# Altium schematic sheet dcdc.SchDoc
size 420 x 297 mm; SheetNumber: 1; SheetTotal: 2
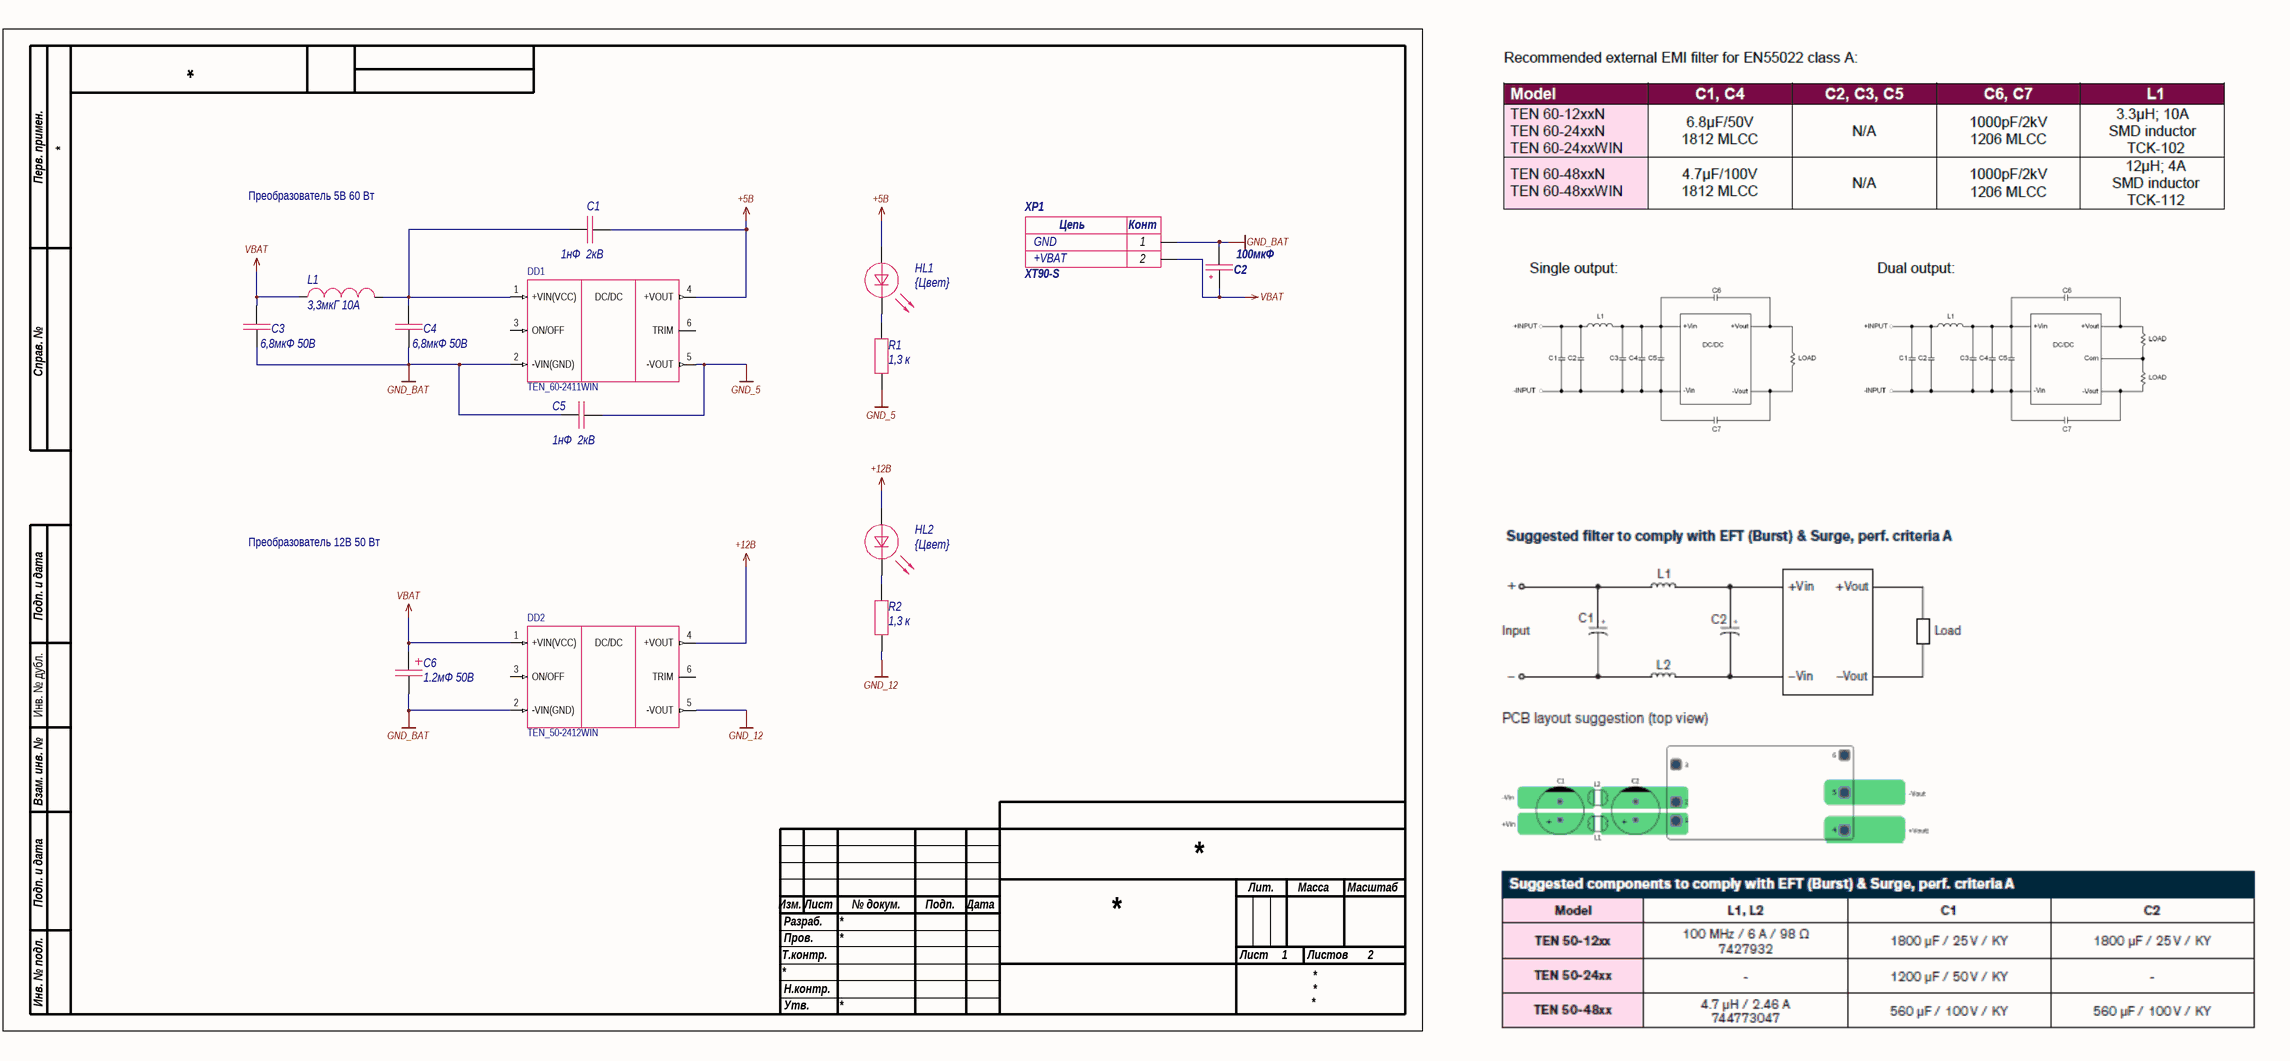
[diagram p0: dcdc.SchDoc]

## Parts
C1  value 1нФ  2кВ  [1206]  (hidden comment: Capacitor)
C2  value 100мкФ  [CAPPR65-350-1150X800X1250]  (hidden comment: 100uF)
C3  value 6,8мкФ 50В  [1812]  (hidden comment: Capacitor)
C4  value 6,8мкФ 50В  [1812]  (hidden comment: Capacitor)
C5  value 1нФ  2кВ  [1206]  (hidden comment: Capacitor)
C6  value 1.2мФ 50В  [THD12.5.25]  (hidden comment: 1uF)
DD1  TEN_60-2411WIN  value DC/DC  [CONV_TEN_60-2411WIN]
DD2  TEN_50-2412WIN  value DC/DC  [CONV_TEN_60-2411WIN]
HL1  Color: {Цвет}  [0805D]
HL2  Color: {Цвет}  [0805D]
L1  value 3,3мкГ 10А  [TCK-102]  (hidden comment: Inductance)
R1  value 1,3 к  [0603R]  (hidden comment: Resistor)
R2  value 1,3 к  [0603R]  (hidden comment: Resistor)
XP1  value XT90-S  Value1: GND  Value2: +VBAT  [AMASS_XT90-M]  (hidden comment: XT-90)

## Nets
+5В: C1.1 DD1.4(+VOUT) HL1.1
+12В: DD2.4(+VOUT) HL2.1
GND_5: C5.1 DD1.5(-VOUT) R1.1
GND_12: DD2.5(-VOUT) R2.1
GND_BAT: C2.2 C3.1 C4.1 C5.2 C6.2 DD1.2(-VIN(GND)) DD2.2(-VIN(GND)) XP1.1
VBAT: C2.1 C3.2 C6.1 DD2.1(+VIN(VCC)) L1.1 XP1.2
NetC1_2: C1.2 C4.2 DD1.1(+VIN(VCC)) L1.2
NetHL1_2: HL1.2 R1.2
NetHL2_2: HL2.2 R2.2

Not connected (* = marked no-connect by the designer): DD1 3(ON/OFF) 6(TRIM); DD2 3(ON/OFF) 6(TRIM)

## Notes on the sheet
- Преобразователь 5В 60 Вт
- Преобразователь 12В 50 Вт
- Перв. примен.
- Справ. №
- Подп. и дата
- Инв. № дубл.
- Взам. инв. №
- Изм.
- Лист
- № докум.
- Подп.
- Дата
- Лит.
- Масса
- Масштаб
- Т.контр.
- Пров.
- Разраб.
- Листов
- Инв. № подл.
- Н.контр.
- Утв.
- (in symbol XT-90) Цепь; Конт

## Library data of the parts
C2 = Capacitor_pol_100uF: Shop: https://www.chipdip.ru/product0/9000565887
C6 = Capacitor_pol: Shop: https://www.chipdip.ru/product0/8003159251 https://www.promelec.ru/product/379547/
DD2 = TEN_60-2411WIN: Price: None; MP: TEN_60-2411WIN; Package: None; Availability: Unavailable
HL1 HL2 = LED: Manufacturer: -; Rate: -; Datasheet: -; Shop: -; Notice: -; Case: -
XP1 = XT-90: Manufacturer: Connfly; Notice: Вилка-мама 2 пина, шаг 2.5мм; Rate: 500В AC 1min; Case: корпус; Datasheet: https://lib.chipdip.ru/413/DOC001413777.pdf; Shop: https://www.chipdip.ru/product/cwf-2
DD1 = TEN_60-2411WIN: Price: None; MP: TEN_60-2411WIN; Package: None; Availability: Unavailable
L1 = Inductance: Shop: https://www.chipdip.ru/product1/8009327451